# EAGLE design hvhc-opamp-v01 (EAGLE 7.7.0)
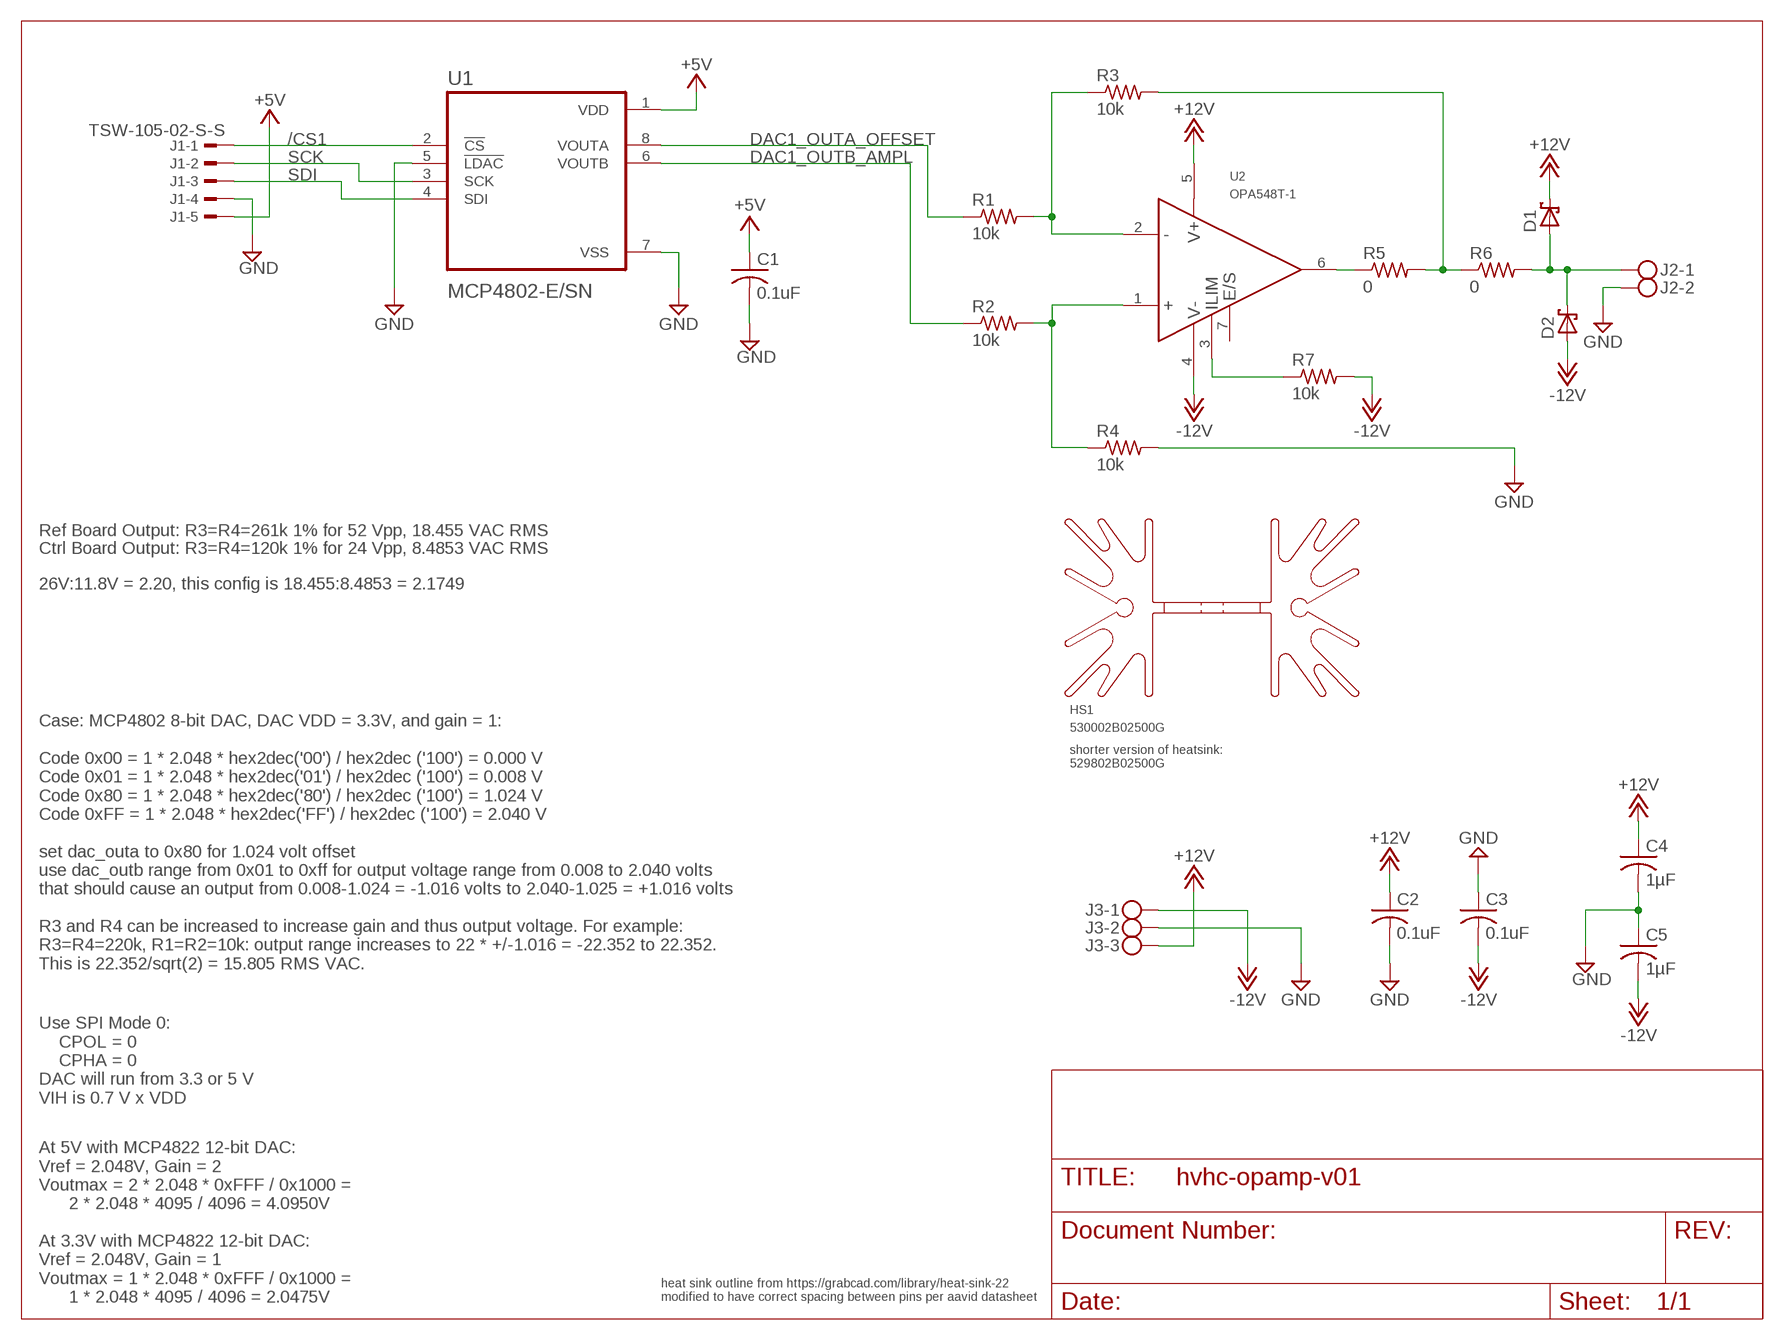
[diagram p0: schematic, sheet 1]

## Parts
C1  0.1uF  C-USC0603K  [C0603K]
C2  0.1uF  C-USC0603K  [C0603K]
C3  0.1uF  C-USC0603K  [C0603K]
C4  1µF  C-USC1206K  [C1206K]
C5  1µF  C-USC1206K  [C1206K]
D1  1N5819-B  [DO41-7.6]
D2  1N5819-B  [DO41-7.6]
HS1  530002B02500G  [530002B02500G]
J1  TSW-105-02-S-S  [TSW-105-02-S-S]
J2  1711725  [1711725]
J3  1711738  [1711738]
R1  10k  R-US_R1206  [R1206]
R2  10k  R-US_R1206  [R1206]
R3  10k  R-US_R1206  [R1206]
R4  10k  R-US_R1206  [R1206]
R5  0  R-US_R1206  [R1206]
R6  0  R-US_R1206  [R1206]
R7  10k  R-US_R1206  [R1206]
U1  MCP4802-E/SN  [SOIC127P600X175-8N]
U2  OPA548T-1  [TO220-7-KC]

## Nets
+: R2.2 R4.1 U2.1(VIN+)
+5V: C1.1 J1.5 U1.1(VDD)
+12V: C2.1 C4.1 D1.C J3.3 U2.5(V+)
-: R1.2 R3.1 U2.2(VIN-)
-12V: C3.2 C5.2 D2.A J3.1 R7.2 U2.4(V-)
/CS1: J1.1 U1.2(!CS)
DAC1_OUTA_OFFSET: R1.1 U1.8(VOUTA)
DAC1_OUTB_AMPL: R2.1 U1.6(VOUTB)
GND: C1.2 C2.2 C3.1 C4.2 C5.1 J1.4 J2.2 J3.2 R4.2 U1.5(!LDAC) U1.7(VSS)
N$1: R5.1 U2.6(VO)
N$2: D1.A D2.C J2.1 R6.2
N$3: R7.1 U2.3(ILIM)
OUT: R3.2 R5.2 R6.1
SCK: J1.2 U1.3(SCK)
SDI: J1.3 U1.4(SDI)
Unconnected: U2.7(E/S)

## Notes on the sheet
- Ref Board Output: R3=R4=261k 1% for 52 Vpp, 18.455 VAC RMS
- Ctrl Board Output: R3=R4=120k 1% for 24 Vpp, 8.4853 VAC RMS
- 26V:11.8V = 2.20, this config is 18.455:8.4853 = 2.1749
- Case: MCP4802 8-bit DAC, DAC VDD = 3.3V, and gain = 1:
  
  Code 0x00 = 1 * 2.048 * hex2dec('00') / hex2dec ('100') = 0.000 V
  Code 0x01 = 1 * 2.048 * hex2dec('01') / hex2dec ('100') = 0.008 V
  Code 0x80 = 1 * 2.048 * hex2dec('80') / hex2dec ('100') = 1.024 V
  Code 0xFF = 1 * 2.048 * hex2dec('FF') / hex2dec ('100') = 2.040 V
  
  set dac_outa to 0x80 for 1.024 volt offset
  use dac_outb range from 0x01 to 0xff for output voltage range from 0.008 to 2.040 volts
  that should cause an output from 0.008-1.024 = -1.016 volts to 2.040-1.025 = +1.016 volts
  
  R3 and R4 can be increased to increase gain and thus output voltage. For example:
  R3=R4=220k, R1=R2=10k: output range increases to 22 * +/-1.016 = -22.352 to 22.352. 
  This is 22.352/sqrt(2) = 15.805 RMS VAC.
- shorter version of heatsink:
  529802B02500G
- Use SPI Mode 0:
      CPOL = 0
      CPHA = 0
  DAC will run from 3.3 or 5 V
  VIH is 0.7 V x VDD
- At 5V with MCP4822 12-bit DAC:
  Vref = 2.048V, Gain = 2
  Voutmax = 2 * 2.048 * 0xFFF / 0x1000 = 
        2 * 2.048 * 4095 / 4096 = 4.0950V
  
  At 3.3V with MCP4822 12-bit DAC:
  Vref = 2.048V, Gain = 1
  Voutmax = 1 * 2.048 * 0xFFF / 0x1000 = 
        1 * 2.048 * 4095 / 4096 = 2.0475V
- heat sink outline from https://grabcad.com/library/heat-sink-22
  modified to have correct spacing between pins per aavid datasheet

## Library data of the parts
C1-C3 = rcl:C-US: CAPACITOR, American symbol; MFR: KEMET; MFR_PART_NO: C1206C104K5RACAUTO
C4 C5 = rcl:C-US: CAPACITOR, American symbol
D1 D2 = diode:1N581*: 1.0A SCHOTTKY BARRIER RECTIFIER Source: http://www.diodes.com/datasheets/ds23001.pdf
HS1 = AAVID-530002B02500G:530002B02500G
J1 = con-samtec:TSW-105-02-S-S: THROUGH-HOLE .025" SQ POST HEADER Source: Samtec TSW.pdf; OC_FARNELL: unknown; OC_NEWARK: unknown
J2 = Phoenix 3.3-5,08:1711725
J3 = Phoenix 3.3-5,08:1711738
R1-R7 = rcl:R-US_: RESISTOR, American symbol
U1 = MCP4802-E_SN:MCP4802-E/SN; DESCRIPTION: DAC 2-CH Resistor-String 8-bit Automotive 8-Pin SOIC N Tube; DIGI-KEY_PART_NUMBER: MCP4802-E/SN-ND; MF: Microchip Technology; MP: MCP4802-E/SN; PACKAGE: SOIC-8 Microchip Technology; PURCHASE-URL: https://pricing.snapeda.com/search/part/MCP4802-E/SN/?ref=eda
U2 = TI OPA548:OPA548T-1

## Board
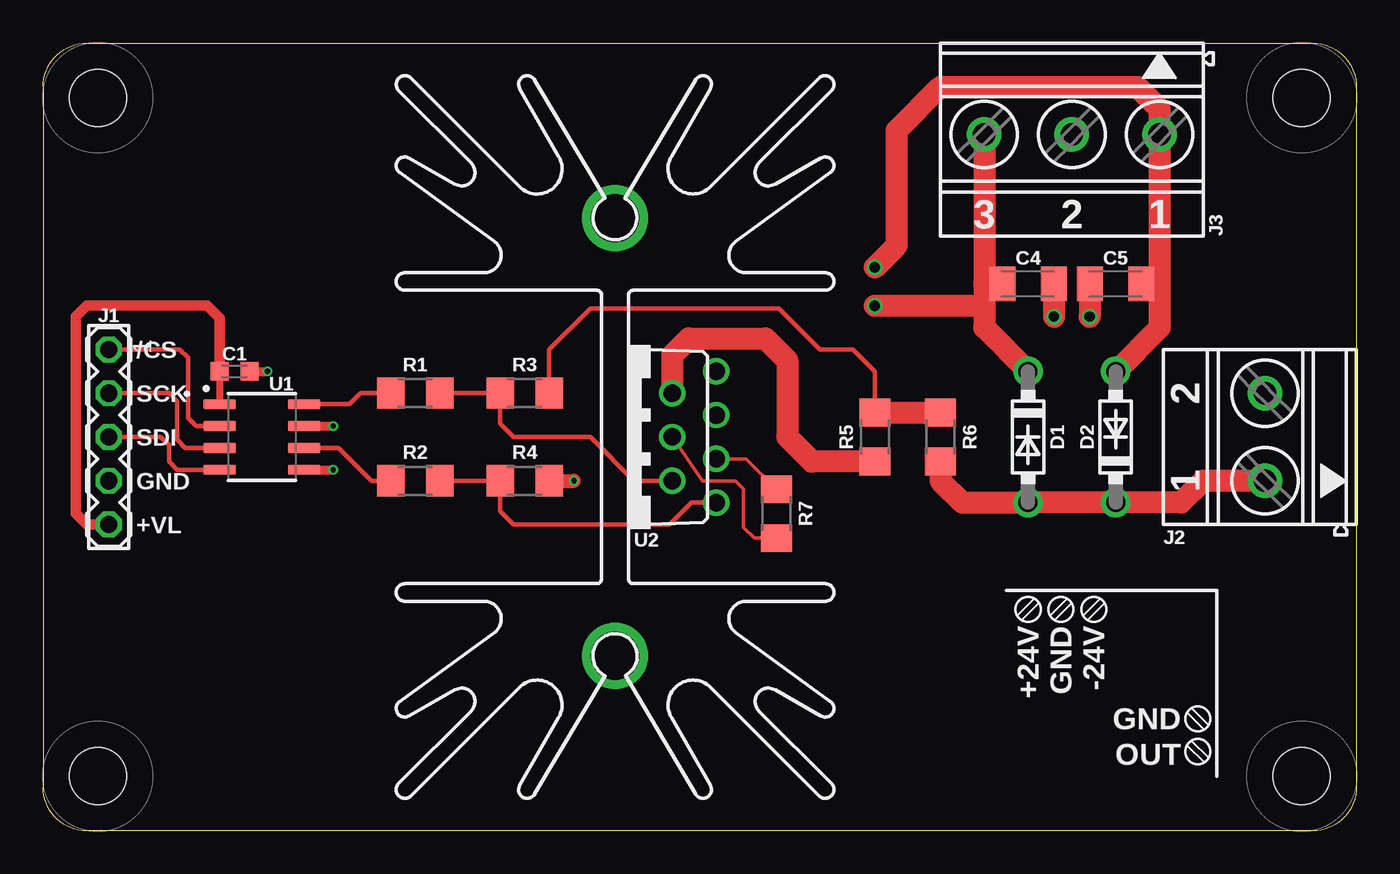
[diagram p1: board, top side]
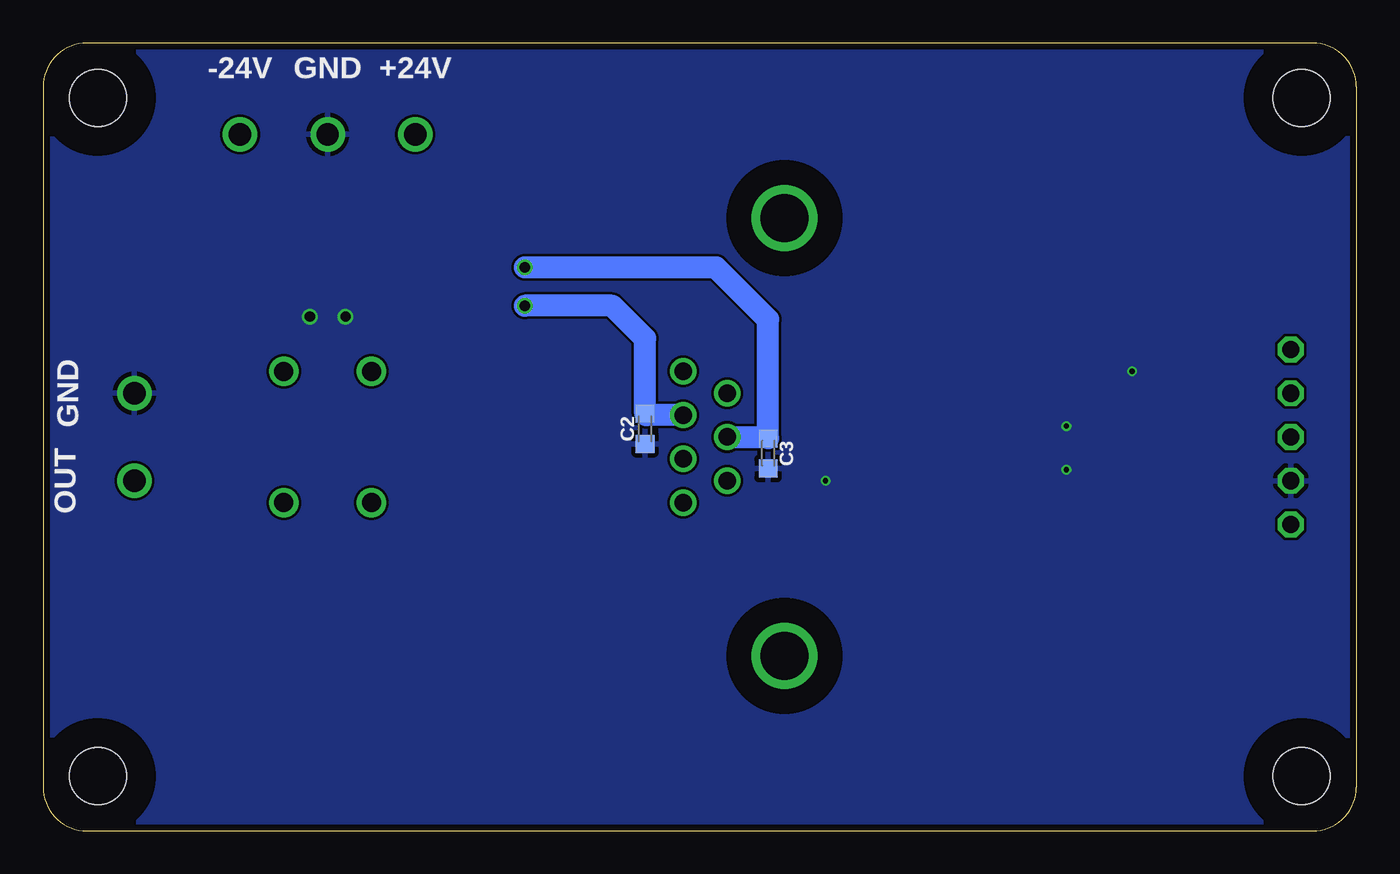
[diagram p2: board, bottom side, seen from below]

Size 76.2 x 45.72 mm. Coordinates in mm from the lower left corner, seen from the top.
Outline: 0,43.18 arc-90 2.54,45.72 73.66,45.72 arc-90 76.2,43.18 76.2,2.54 arc-90 73.66,0 2.54,0 arc-90 0,2.54 0,43.18
Copper layers (1*16): Top 0.035559375mm / dielectric 1.6mm / Bottom 0.035559375mm
Design rules "oshpark-2layer-2018": minimum track width 6mil, minimum drill 10mil, track to track 6mil, track to pad 6mil, pad to pad 6mil, via to via 6mil, smd to smd 6mil, copper to edge 15mil, drill to drill 6mil, minimum pad ring 5mil, minimum via ring 5mil, stop-mask expansion 2.5mil, vias tented up to drill 0mil, thermal gap 10mil
Holes 3.3 mm at 3.17,3.17 3.17,42.55 73.03,42.55 73.03,3.17
tRestrict: area 0,0 to 6.4,6.4; area 0,39.3 to 6.4,45.7; area 69.8,39.3 to 76.2,45.7; area 69.8,0 to 76.2,6.4
bRestrict: area 0,0 to 6.4,6.4; area 0,39.3 to 6.4,45.7; area 69.8,39.3 to 76.2,45.7; area 69.8,0 to 76.2,6.4; area 30,32.4 to 36.4,38.8; area 30,7 to 36.4,13.4

### Footprints (pad centres in the part's own frame; a part is rotated, then mirrored left to right if it is on the bottom)
C0603K = smd 1.05 x 1.08: 1 -0.875,0; 2 0.875,0
C1206K = smd 1.5 x 2: 1 -1.5,0; 2 1.5,0
DO41-7.6 = drill 1.1 pad 1.7: A 3.81,0; C -3.81,0
530002B02500G = drill 2.8: P$1 -12.7,0; P$2 12.7,0
TSW-105-02-S-S = drill 1 pad 1.5 octagon: 1 5.08,0; 2 2.54,0; 3 0,0; 4 -2.54,0; 5 -5.08,0
1711725 = drill 1.3 pad 2: 1 -2.54,0; 2 2.54,0
1711738 = drill 1.3 pad 2: 1 -5.08,0; 2 0,0; 3 5.08,0
R1206 = smd 1.6 x 1.803: 1 -1.422,0; 2 1.422,0
SOIC127P600X175-8N = smd 1.9 x 0.6: 1 -2.455,1.905; 2 -2.455,0.635; 3 -2.455,-0.635; 4 -2.455,-1.905; 5 2.455,-1.905; 6 2.455,-0.635; 7 2.455,0.635; 8 2.455,1.905
TO220-7-KC = drill 1.016: 1 -3.81,-5.08; 3 -1.27,-5.08; 4 0,-2.54; 5 1.27,-5.08; 6 2.54,-2.54; 7 3.81,-5.08 | drill 1.016 pad 1.524: 2 -2.54,-2.54

### Placement (x,y rotation side)
C1  11.11,26.67 0 top
C2  41.27,23.34 270 bottom
C3  34.13,21.91 90 bottom
C4  57.15,31.75 0 top
C5  62.23,31.75 0 top
D1  57.15,22.86 270 top
D2  62.23,22.86 90 top
HS1  33.19,22.86 90 top
J1  3.81,22.86 90 top
J2  70.9,22.86 90 top
J3  59.69,40.42 180 top
R1  21.59,25.4 0 top
R2  21.59,20.32 0 top
R3  27.94,25.4 0 top
R4  27.94,20.32 0 top
R5  48.26,22.86 90 top
R6  52.07,22.86 270 top
R7  42.55,18.41 270 top
U1  12.7,22.86 0 top
U2  33.97,22.86 90 top

### Tracks (layer width: path | path; a pad name or v marks a point on that pad's centre or on a via)
+
  Top 0.254: R2.2 R4.1 26.52,18.57 27.3,17.78 36.35,17.78 37.62,19.05 U2.1
+5V
  Top 0.406: C1.1 U1.1
  Top 0.508: U1.1
  Top 0.61: J1.5 2.54,17.78 1.91,18.41 1.91,29.84 2.54,30.48 9.53,30.48 10.24,29.77 C1.1
+12V  (via drill 0.6)
  Top 1.27: J3.3 54.61,31.75 | 54.61,31.75 54.61,30.48 | 54.61,30.48 54.61,29.21 D1.C | v48.26,30.48 54.61,30.48 | C4.1 54.61,31.75
  Bottom 0.813: 41.19,24.13 C2.1
  Bottom 1.27: v48.26,30.48 43.18,30.48 41.27,28.57 C2.1 | U2.5 41.19,24.13
-
  Top 0.254: R1.2 R3.1 26.52,23.65 27.3,22.86 31.75,22.86 34.29,20.32 U2.2
-12V  (via drill 0.6)
  Top 0.203: R7.2 41.27,16.99 40.64,17.62 40.64,19.84 40.16,20.32 38.26,20.32 U2.4
  Top 1.27: 64.77,31.75 J3.1 64.77,41.91 63.5,43.18 52.07,43.18 49.53,40.64 49.53,33.97 v48.26,32.7 | 64.77,31.75 64.77,29.21 D2.A | C5.2 64.77,31.75
  Bottom 0.813: 34.21,22.86 C3.2
  Bottom 1.27: v48.26,32.7 37.15,32.7 34.13,29.69 C3.2 | U2.4 34.21,22.86
/CS1
  Top 0.254: U1.2 8.89,23.5 8.41,23.97 8.41,27.46 7.94,27.94 J1.1
DAC1_OUTA_OFFSET
  Top 0.254: U1.8 17.78,24.77 18.41,25.4 R1.1
DAC1_OUTB_AMPL
  Top 0.254: U1.6 17.14,22.23 19.05,20.32 R2.1
GND  (via drill 0.3, 0.6)
  Top 0.508: U1.7 v16.83,23.5 | U1.5 v16.83,20.95 | C1.2 v13.02,26.67
  Top 0.813: R4.2 v30.8,20.32
  Top 1.27: C4.2 v58.65,29.84 | C5.1 v60.73,29.84
  pour Bottom (isolate 0.152): 0,45.72 76.2,45.72 76.2,0 0,0
N$1
  Top 1.27: U2.6 36.51,27.62 37.47,28.57 41.91,28.57 43.18,27.3 43.18,22.86 44.6,21.44 R5.1
N$2
  Top 1.27: J2.1 67.31,20.32 66.04,19.05 D2.C D1.A 53.34,19.05 52.07,20.32 R6.2
N$3
  Top 0.203: U2.3 40.79,21.59 R7.1
OUT
  Top 0.254: R3.2 29.36,27.93 31.75,30.32 42.7,30.32 45.09,27.94 46.99,27.94 48.26,26.67 R5.2
  Top 1.27: R5.2 R6.1
SCK
  Top 0.254: J1.2 7.3,25.4 7.78,24.92 7.78,22.7 8.26,22.23 U1.3
SDI
  Top 0.254: J1.3 6.83,22.86 7.3,22.38 7.3,21.43 7.78,20.95 U1.4

### Text on the board
_tsilk: 3 | 2 | 1 | J3 | C4 | C5 | J1 | /CS | C1 | R1 | R3 | U1 | SCK | 2 | SDI | R5 | R6 | D1 | D2 | R2 | R4 | GND | 1 | +VL | R7 | U2 | J2 | +24V | GND | -24V | GND | OUT
_bsilk: +24V | GND | -24V | GND | C2 | C3 | OUT